# Altium schematic sheet SPI Title Page.SchDoc
size A
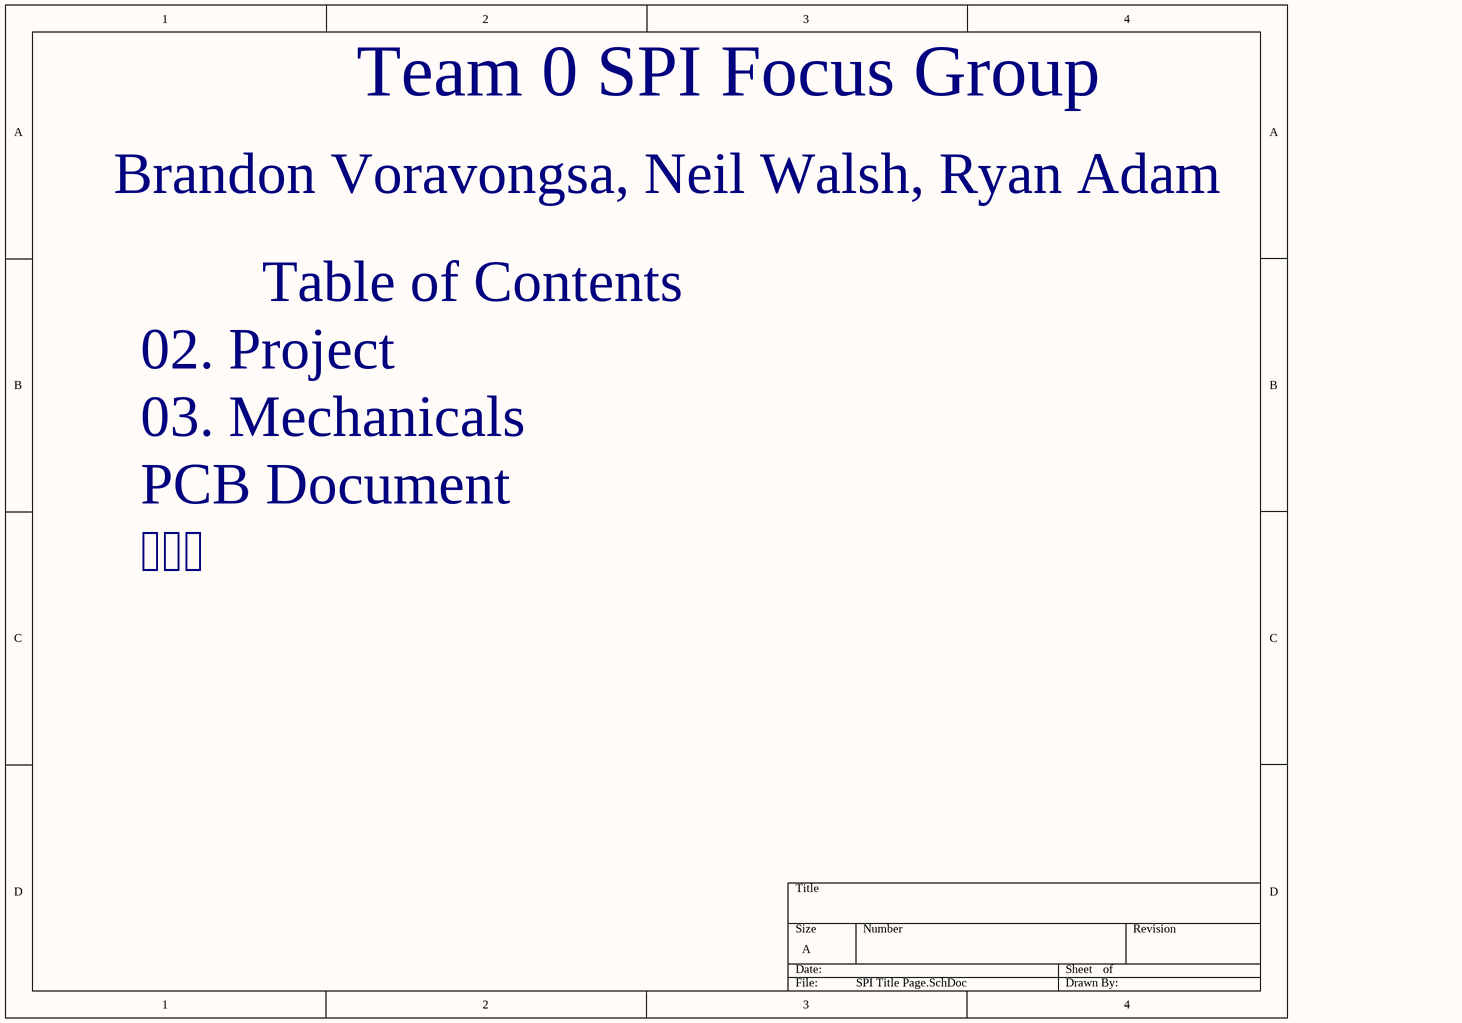
[diagram p0: SPI Title Page.SchDoc]

## Notes on the sheet
- Team 0 SPI Focus Group
- Brandon Voravongsa, Neil Walsh, Ryan Adam
- Table of Contents
- 02. Project
- 03. Mechanicals
- PCB Document
- 